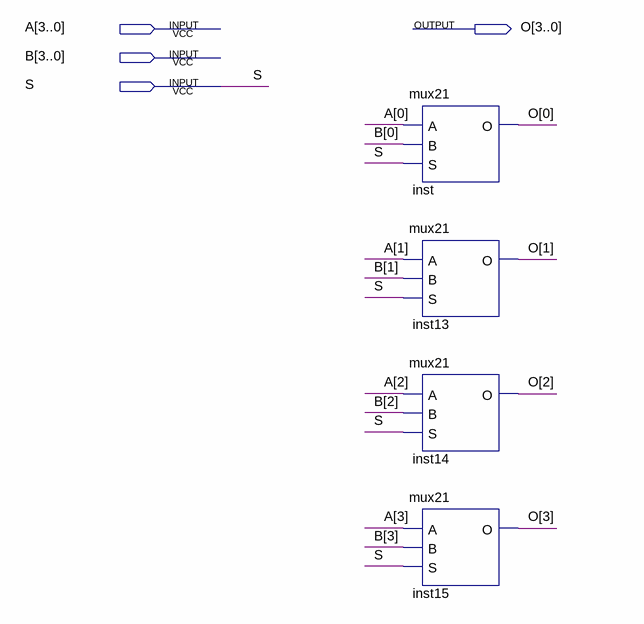
[diagram p0: schematic sheet]
// Quartus schematic mux21_4bit.bdf as structural Verilog: 4 symbols, 4 pins
module mux21_4bit (
  input  [3:0] A,
  input  [3:0] B,
  input  S,
  output [3:0] O
);

  mux21 inst (.A(A[0]), .B(B[0]), .S(S), .O(O[0]));
  mux21 inst13 (.A(A[1]), .B(B[1]), .S(S), .O(O[1]));
  mux21 inst14 (.A(A[2]), .B(B[2]), .S(S), .O(O[2]));
  mux21 inst15 (.A(A[3]), .B(B[3]), .S(S), .O(O[3]));
endmodule
